# Altium schematic sheet USB Downstream Type C Port 2.SchDoc: DO NOT FILL THIS IN
size Tabloid; Date: DO NOT FILL THIS IN; ApprovedBy: DO NOT FILL THIS IN; CheckedBy: DO NOT FILL THIS IN; Author: DO NOT FILL THIS IN; CompanyName: DO NOT FILL THIS IN; DrawnBy: DO NOT FILL THIS IN; Engineer: DO NOT FILL THIS IN; Organization: DO NOT FILL THIS IN; Address1: DO NOT FILL THIS IN; Address2: DO NOT FILL THIS IN; Address3: DO NOT FILL THIS IN; Address4: DO NOT FILL THIS IN; DocumentNumber: DO NOT FILL THIS IN; Revision: DO NOT FILL THIS IN; SheetNumber: 6; SheetTotal: 9; PageSetup: Record=PageOptions|CenterHorizontal=True|CenterVertical=True|PrintScale=1.00|XCorrection=1.00|YCorrection=1.00|PrintKind=1|BorderSize=5000000|LeftOffset=0|BottomOffset=0|Orientation=2|PaperLength=1000|PaperWidth=1000|Scale=100|PaperSource=7|PrintQuality=-4|MediaType=1|DitherType=10|PaperKind=Ledger|PrintScaleMode=1; cpr-ItemNumber: 025619; cpr-ItemName1: TurtleBot4 UI board; cpr-ItemName2: Rev 2; cpr-Revision: 2; cpr-SheetNumber: 6; cpr-SheetTotal: 9; cpr-Draft: AG; cpr-DraftDate: 19/04/2022; Time: DO NOT FILL THIS IN; ImagePath: DO NOT FILL THIS IN; Application_BuildNumber: DO NOT FILL THIS IN
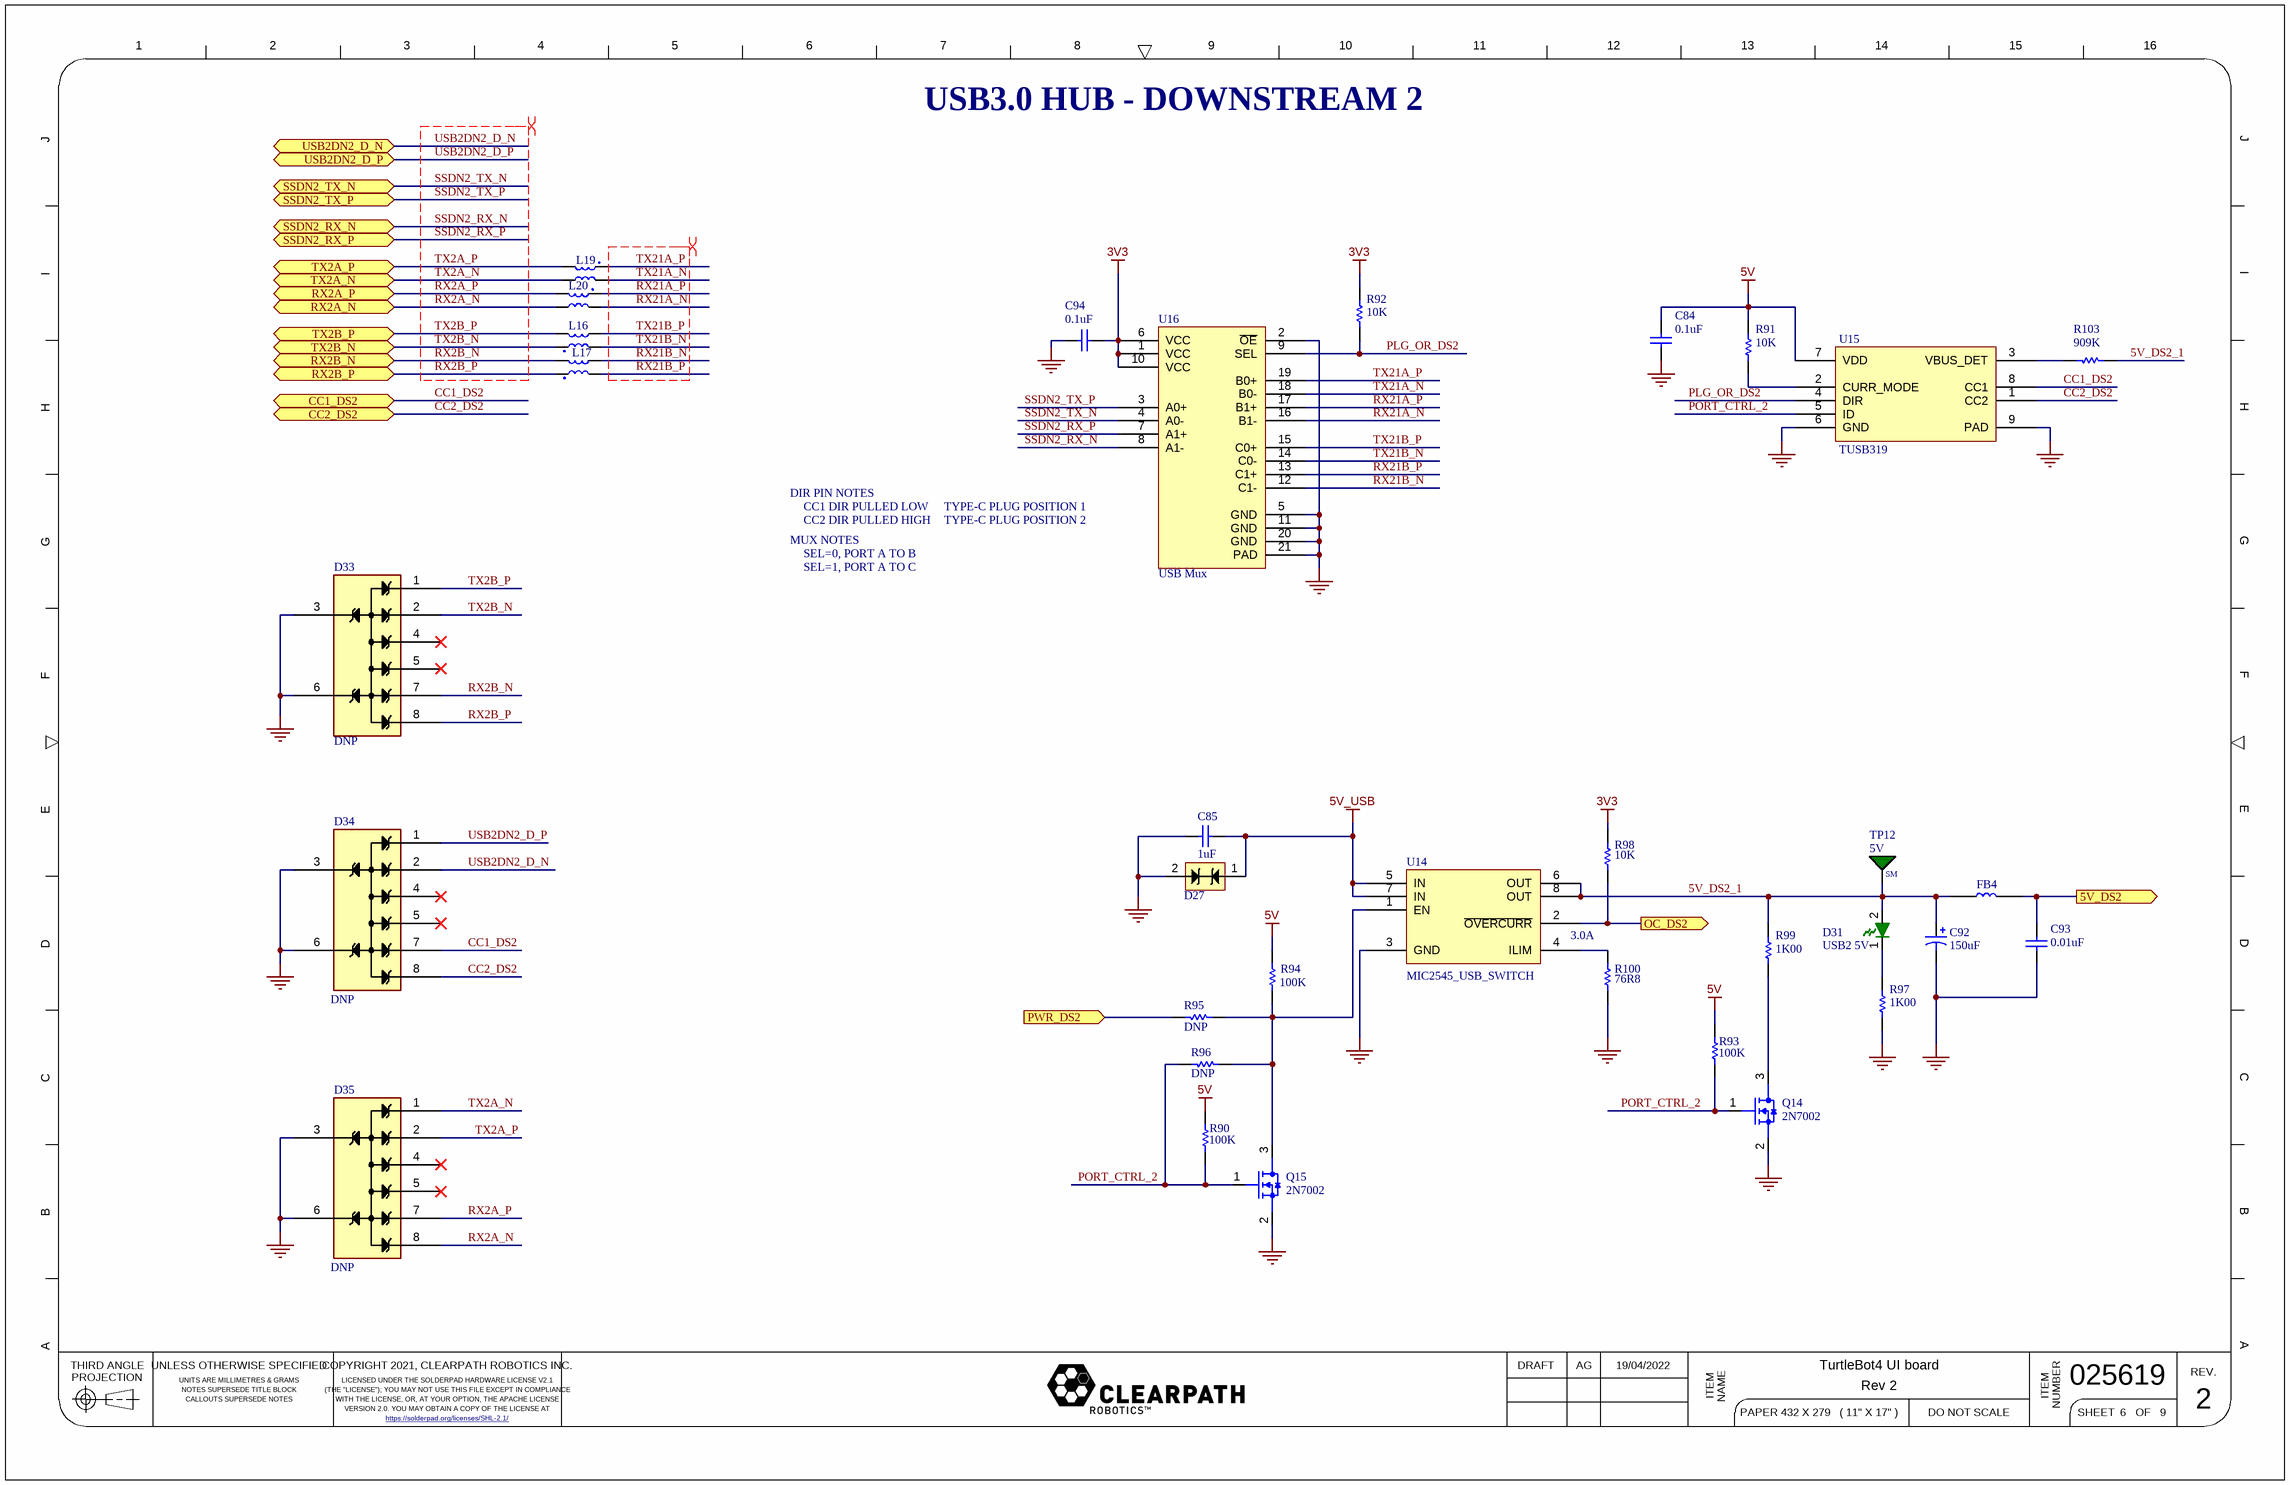
[diagram p0: USB Downstream Type C Port 2.SchDoc]

## Parts
C84  value 0.1uF  [C0805]  (hidden comment: Capacitor _SMT)
C85  value 1uF  [C0805]  (hidden comment: Capacitor _SMT)
C92  value 150uF  [CAPMP7.6X4.3_3.1N_KEM-M]  (hidden comment: Cap Tant)
C93  value 0.01uF  [C0805]  (hidden comment: Capacitor _SMT)
C94  value 0.1uF  [C0805]  (hidden comment: Capacitor _SMT)
D27  TVS DIODE BIDIR 15V SMC  [DO-214AA]  (value not drawn)
D31  USB2 5V  [LED_0805_GRN]
D33  DNP  [ESD7016]
D34  DNP  [ESD7016]
D35  DNP  [ESD7016]
FB4  742792602  [R0603]  (value not drawn)
L16  CMC 100MA 2LN 90 OHM SMD2  [cmc_90_ohms]  (value not drawn)
L17  CMC 100MA 2LN 90 OHM SMD2  [cmc_90_ohms]  (value not drawn)
L19  CMC 100MA 2LN 90 OHM SMD2  [cmc_90_ohms]  (value not drawn)
L20  CMC 100MA 2LN 90 OHM SMD2  [cmc_90_ohms]  (value not drawn)
Q14  Mfg PN: 2N7002  [SOT-23-3]  (hidden comment: NFET)
Q15  Mfg PN: 2N7002  [SOT-23-3]  (hidden comment: NFET)
R90  value 100K  [R0805]  (hidden comment: Resistor_SMT)
R91  value 10K  [R0805]  (hidden comment: Resistor_SMT)
R92  value 10K  [R0805]  (hidden comment: Resistor_SMT)
R93  value 100K  [R0805]  (hidden comment: Resistor_SMT)
R94  value 100K  [R0805]  (hidden comment: Resistor_SMT)
R95  value DNP  [R0805]  (hidden comment: Resistor_SMT)
R96  value DNP  [R0805]  (hidden comment: Resistor_SMT)
R97  value 1K00  [R0805]  (hidden comment: Resistor_SMT)
R98  value 10K  [R0805]  (hidden comment: Resistor_SMT)
R99  value 1K00  [R0805]  (hidden comment: Resistor_SMT)
R100  3.0A  value 76R8  [R0805]
R103  value 909K  [R0805]  (hidden comment: Resistor_SMT)
TP12  5V  [TP_28SM]
U14  MIC2545_USB_SWITCH  [SOIC-8-150]
U15  TUSB319  [WSON8]
U16  USB Mux  [TQFN20]

## Ports
5V_DS2 (out), CC1_DS2 (bidir), CC2_DS2 (bidir), OC_DS2 (out), PWR_DS2 (in), RX2A_N (bidir), RX2A_P (bidir), RX2B_N (bidir), RX2B_P (bidir), SSDN2_RX_N (bidir), SSDN2_RX_P (bidir), SSDN2_TX_N (bidir), SSDN2_TX_P (bidir), TX2A_N (bidir), TX2A_P (bidir), TX2B_N (bidir), TX2B_P (bidir), USB2DN2_D_N (bidir), USB2DN2_D_P (bidir)

## Nets
3V3: C94.1 R92.1 R98.1 U16.1(VCC) U16.6(VCC) U16.10(VCC)
5V: C84.1 R90.2 R91.1 R93.2 R94.2 U15.7(VDD)
5V_USB: C85.2 D27.1 U14.5(IN) U14.7(IN)
GND: C84.2 C85.1 C92.2 C93.2 C94.2 D27.2 D33.3 D33.6 D34.3 D34.6 D35.3 D35.6 Q14.2(D1) Q15.2(D1) R97.2 R100.1 U14.3(GND) U15.6(GND) U15.9(PAD) U16.2(~{OE}) U16.5(GND) U16.11(GND) U16.20(GND) U16.21(PAD)
5V_DS2: C93.1 FB4.2 ; port 5V_DS2
5V_DS2_1: C92.1 D31.2(RA) FB4.1 R99.1 R103.2 TP12.1 U14.6(OUT) U14.8(OUT)
CC1_DS2: D34.7 U15.8(CC1) ; port CC1_DS2
CC2_DS2: D34.8 U15.1(CC2) ; port CC2_DS2
OC_DS2: R98.2 U14.2(~{OVERCURR}) ; port OC_DS2
PLG_OR_DS2: R92.2 U15.4(DIR) U16.9(SEL)
PORT_CTRL_2: Q14.1(G1) Q15.1(G1) R90.1 R93.1 R96.1 U15.5(ID)
PWR_DS2: R95.1 ; port PWR_DS2
RX2A_N: D35.8 L20.3 ; port RX2A_N
RX2A_P: D35.7 L20.4 ; port RX2A_P
RX2B_N: D33.7 L17.2 ; port RX2B_N
RX2B_P: D33.8 L17.1 ; port RX2B_P
RX21A_N: L20.2 U16.16(B1-)
RX21A_P: L20.1 U16.17(B1+)
RX21B_N: L17.3 U16.12(C1-)
RX21B_P: L17.4 U16.13(C1+)
SSDN2_RX_N: U16.8(A1-) ; port SSDN2_RX_N
SSDN2_RX_P: U16.7(A1+) ; port SSDN2_RX_P
SSDN2_TX_N: U16.4(A0-) ; port SSDN2_TX_N
SSDN2_TX_P: U16.3(A0+) ; port SSDN2_TX_P
TX2A_N: D35.1 L19.3 ; port TX2A_N
TX2A_P: D35.2 L19.4 ; port TX2A_P
TX2B_N: D33.2 L16.1 ; port TX2B_N
TX2B_P: D33.1 L16.2 ; port TX2B_P
TX21A_N: L19.2 U16.18(B0-)
TX21A_P: L19.1 U16.19(B0+)
TX21B_N: L16.4 U16.14(C0-)
TX21B_P: L16.3 U16.15(C0+)
USB2DN2_D_N: D34.2 ; port USB2DN2_D_N
USB2DN2_D_P: D34.1 ; port USB2DN2_D_P
NetD31_1: D31.1(RK) R97.1
NetQ14_3: Q14.3(S1) R99.2
NetQ15_3: Q15.3(S1) R94.1 R95.2 R96.2 U14.1(EN)
NetR91_2: R91.2 U15.2(CURR_MODE)
NetR100_2: R100.2 U14.4(ILIM)
NetR103_1: R103.1 U15.3(VBUS_DET)

Not connected (* = marked no-connect by the designer): D33 4* 5*; D34 4* 5*; D35 4* 5*

## Layout directives
differential pair; net class USB3; differential pair class DIFF90; rule Matched Net Lengths [Tolerance = 15mil]: RX2A_N, RX2A_P, RX2B_N, RX2B_P, RX21A_N, RX21A_P, RX21B_N, RX21B_P, SSDN2_RX_N, SSDN2_RX_P, SSDN2_TX_N, SSDN2_TX_P, TX2A_N, TX2A_P, TX2B_N, TX2B_P, TX21A_N, TX21A_P, TX21B_N, TX21B_P, USB2DN2_D_N, USB2DN2_D_P

## Notes on the sheet
- USB3.0 HUB - DOWNSTREAM 2
- DIR PIN NOTES
- MUX NOTES
- CC1 DIR PULLED LOW
- CC2 DIR PULLED HIGH
- SEL=0, PORT A TO B
- SEL=1, PORT A TO C
- TYPE-C PLUG POSITION 1
- TYPE-C PLUG POSITION 2
- 1
- 2
- 3
- 4
- 5
- 6
- 7
- 8
- 9
- 10
- 11
- 12
- 13
- 14
- 15
- 16
- J
- I
- H
- G
- F
- E
- D
- C
- B
- A
- THIRD ANGLE
- PROJECTION
- UNLESS OTHERWISE SPECIFIED
- COPYRIGHT 2021, CLEARPATH ROBOTICS INC.
- DRAFT
- REV.
- UNITS ARE MILLIMETRES & GRAMS
- NOTES SUPERSEDE TITLE BLOCK
- CALLOUTS SUPERSEDE NOTES
- LICENSED UNDER THE SOLDERPAD HARDWARE LICENSE V2.1
- (THE "LICENSE"); YOU MAY NOT USE THIS FILE EXCEPT IN COMPLIANCE
- WITH THE LICENSE, OR, AT YOUR OPTION, THE APACHE LICENSE
- VERSION 2.0. YOU MAY OBTAIN A COPY OF THE LICENSE AT
- https://solderpad.org/licenses/SHL-2.1/ <https://solderpad.https://solderpad.org/licenses/SHL-2.1/org/licenses/SHL-2.1/>
- ITEM
- NAME
- PAPER 432 X 279   ( 11" X 17" )
- DO NOT SCALE
- NUMBER
- SHEET
- OF
- (in symbol TP_28SM) SM

## Library data of the parts
C84 C94 = Capacitor _SMT: Capacitor; Tolerance: 10%; Voltage: 50V; Vendor: Digikey; Vendor PN: 311-1140-1-ND; Mfg: Yageo; Mfg PN: CC0805KRX7R9BB104; DNP: *; Package: 0805
C85 = Capacitor _SMT: Capacitor; Tolerance: -20 +80; Voltage: 50V; Vendor: Digikey; Vendor PN: 311-1909-1-ND; Mfg: Yageo; Mfg PN: CC0805ZKY5V9BB105; DNP: *; Package: 0805
C92 = Cap Pol1: CAP TANT 150UF 10% 16V 2917; Vendor: Digikey; Mfg PN: 293D157X9016D2TE3; Vendor PN: 718-1746-1-ND; Mfg: Vishay Sprague; Voltage: 16V; Tolerance: 10%; Package: 2917; Supplier 1: Digi-Key; Supplier Part Number 1: 718-1746-1-ND
C93 = Capacitor _SMT: Capacitor; Tolerance: 10%; Voltage: 50V; Vendor: Digikey; Vendor PN: 1276-CL10B103KB8WPNDCT-ND; Mfg: Samsung Electro-Mechanics; Mfg PN: CL10B103KB8WPND; DNP: *; Package: 0603; Supplier 1: Digi-Key; Supplier Part Number 1: 1276-CL10B103KB8WPNDCT-ND
D27 = TVS DIODE BIDIR 15V SMC: TVS 600W 15V BI-DIR DO-214AA; Vendor: Digikey; Vendor PN: 18-SMA6J5.0CACT-ND; Mfg: Littelfuse Inc.; Mfg PN: SMA6J5.0CA; Package: DO214AC; Supplier 1: Digi-Key; Supplier Part Number 1: 18-SMA6J5.0CACT-ND
D31 = GREEN_LED: Green LED; Vendor: Digikey; Mfg PN: LTST-C170KGKT; Mfg: LiteOn; Vendor 1: 160-1414-1-ND; Package: 0805
D33-D35 = ESD7016: USB3 TVS diode assy; Vendor 1: Digikey; Vendor 1 PN: ESD7016MUTAGOSCT-ND; Mfg: ON Semi; Mfg PN: ESD7016MUTAG; Vendor 2 PN: *; Vendor 2: *
FB4 = 742792602: 60 Ohms 1 Signal Line Ferrite Bead 0603 (1608 Metric) 3A 40mOhm; Supplier 1: Digi-Key; Supplier Part Number 1: 732-4660-1-ND
L16 L17 L19 L20 = CMC 90_Ohms: Line Common Mode Choke Surface Mount 90 Ohms 100mA DCR 5Ohm; Supplier 1: Digi-Key; Supplier Part Number 1: 490-16595-1-ND
Q14 Q15 = NFET_SNGL: Vendor: Digikey; Vendor PN: 2N7002NCT-ND; Mfg: ON Semi; Package: SOT23-3
R90 R93 R94 = Resistor_SMT: Resistor; Vendor: Digikey; Vendor PN: 311-100KCRCT-ND; Tolerance: 1%; Mfg: Yageo; Mfg PN: RC0805FR-07100KL; Power Rating: *; Package: 0805
R91 R92 R98 = Resistor_SMT: Resistor; Vendor: Digikey; Vendor PN: 311-10.0KCRCT-ND; Tolerance: 1%; Mfg: Yageo; Mfg PN: RC0805FR-0710KL; Power Rating: *; Package: 0805
  R98: Supplier 1: Digi-Key; Supplier Part Number 1: 311-10.0KCRTR-ND
R95 R96 = Resistor_SMT: Resistor; Vendor: Digikey; Vendor PN: 311-0.0ARCT-ND; Mfg: Yageo; Mfg PN: RC0805JR-070RL; Power Rating: *; Package: 0805
R97 R99 = Resistor_SMT: Resistor; Vendor: Digikey; Vendor PN: 311-1.00KCRCT-ND; Tolerance: 1%; Mfg: Yageo; Mfg PN: RC0805FR-071KL; Power Rating: *; Package: 0805
R100 = Resistor_SMT: Resistor; Vendor: Digikey; Vendor PN: 311-76.8CRCT-ND; Tolerance: 1%; Mfg: Yageo; Mfg PN: RC0805FR-0776R8L; Power Rating: *; Package: 0805
R103 = Resistor_SMT: Resistor; Vendor: Digikey; Vendor PN: 311-909KCRCT-ND; Tolerance: 1%; Mfg: Yageo; Mfg PN: RC0805FR-07909KL; Power Rating: *; Package: 0805
TP12 = TP_28SM: Test point, 28 Mil exposed pad; Manufacturer: Clearpath Robotics Inc.; ID: 1; PCB Component: TP_28SM; Status: Draft; Vendor: Clearpath Robotics Inc.; Vendor PN: TP_28SM; Type: SM Pad; Features: Exposed 28mil pad; Octopart Link: N/A
U14 = MIC2545_USB_SWITCH: IC PWR SWITCH N-CHAN 1:1 8SOIC; Vendor PN: MIC2545A-1YM-CT-ND; Vendor: Digikey; Mfg PN: MIC2545A-1YM-TR; Mfg: Microchip; Package: SOIC8
U15 = TUSB319: USB Type C Controller; Vendor 1 PN: 595-TUSB319IDRFRQ1; Vendor 1: Mouser; Mfg PN: TUSB319IDRFRQ1; Mfg: Texas Instruments; Package: WSON8
U16 = TC7PCI3212: TC7PCI3212MT,LF USB3.0 Mux; Manufacturer: Toshiba; Vendor 1 PN: 757-TC7PCI3212MTLF; Vendor 1: Mouser; Package: TQFN-20; Mfg PN: TC7PCI3212MT,LF